# Altium schematic sheet USB.SchDoc: =VariantName
size 274 x 177 mm; SheetNumber: 6; SheetTotal: 7
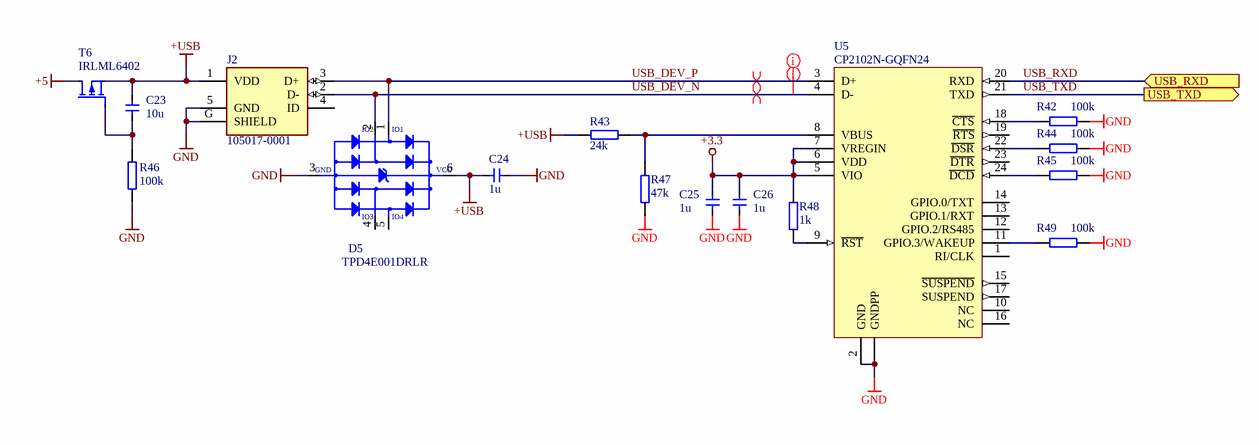
[diagram p0: USB.SchDoc]

## Parts
C23  10u  [C0805]
C24  1u  [C0805]
C25  1u  [C0805]
C26  1u  [C0805]
D5  TPD4E001DRLR  [DRL_R-PDSO-N6]
J2  105017-0001  [MOLEX_105017-0001]
R42  100k  [R0805]
R43  24k  [R0805]
R44  100k  [R0805]
R45  100k  [R0805]
R46  100k  [R0805]
R47  47k  [R0805]
R48  1k  [R0805]
R49  100k  [R0805]
T6  IRLML6402  [MICRO3]
U5  CP2102N-GQFN24  [RGE_S-PVQFN-N24-B]

## Ports
USB_RXD (in), USB_TXD (out)

## Nets
+3.3: C25.2 C26.1 R48.1 U5.5(VIO) U5.6(VDD) U5.7(VREGIN)
+5: T6.D
+USB: C23.2 C24.2 D5.6 J2.1(VDD) R43.1 T6.S
GND: C24.1 C25.1 C26.2 D5.3 J2.5(GND) J2.G(SHIELD) R42.1 R44.1 R45.1 R46.1 R47.1 R49.1 U5.0(GNDPP) U5.2(GND)
USB_DEV_N: D5.2 J2.2(D-) U5.4(D-)
USB_DEV_P: D5.1 J2.3(D+) U5.3(D+)
USB_RXD: U5.20(RXD) ; port USB_RXD
USB_TXD: U5.21(TXD) ; port USB_TXD
NetC23_1: C23.1 R46.2 T6.G
NetR42_2: R42.2 U5.18(~{CTS})
NetR43_2: R43.2 R47.2 U5.8(VBUS)
NetR44_2: R44.2 U5.22(~{DSR})
NetR45_2: R45.2 U5.24(~{DCD})
NetR48_2: R48.2 U5.9(~{RST})
NetR49_2: R49.2 U5.11(GPIO.3/WAKEUP)

Not connected (* = marked no-connect by the designer): D5 4 5; J2 4(ID); U5 1(RI/CLK) 10(NC) 12(GPIO.2/RS485) 13(GPIO.1/RXT) 14(GPIO.0/TXT) 15(~{SUSPEND}) 16(NC) 17(SUSPEND) 19(~{RTS}) 23(~{DTR})

## Layout directives
net class usb: USB_DEV_N, USB_DEV_P
differential pair: USB_DEV_N, USB_DEV_P

## Notes on the sheet
- Name:
- Device:
- File:
- (in symbol TPD4E001DRLR) IO2; IO1; GND; VCC; IO3; IO4

## Library data of the parts
C23 C24 = c: C; capacitor; Indeks: MKOS0603021; P&P: 1
  C23: Value: 10u
  C24: Value: 1u
C25 = C: capacitor; Indeks: MKOS0603021; Nap robocze: 10V; Technologia: X5R; P&P: 1; Value: 1u
C26 = C: capacitor; Indeks: MKOS0603021; Nap robocze: 10V; P&P: 1; Value: 1u
D5 = TPD4E001DRLR: D_; ESD Protection; Indeks: MUKSA198; P&P: 1; Value: TPD4E001DRLR
J2 = 105017-0001: CON; USB; micro B USB 2.0 Receptacle Connector 5 Position Surface Mount, Right Angle; Through Hole; Indeks: MZLZK191; P&P: 1; Value: 105017-0001
R42 R44 R45 R49 = R: resistor; Indeks: MRESR0603013; Tolerancja: 1%; P&P: 1; Value: 100k
R43 = R: resistor; Indeks: MRESR0603059; P&P: 1; Value: 24k
R46 = R: R; resistor; Value: 100k; Indeks: *; P&P: *
R47 = R: resistor; Indeks: MRESR0603035; P&P: 1; Value: 47k
R48 = R: resistor; Indeks: MRESR0603017; P&P: 1; Value: 1k
T6 = IRLML6402: T_M_P; P-Channel MOSFET; Indeks: MTRSP030; P&P: 1; Value: IRLML6402
U5 = CP2102N-xxx-GQFN24: USB-to-UART (USB 2.0 Full-Speed) Bridge Controller; Indeks: MUKSC1012; P&P: 1; Value: CP2102N-GQFN24